# EAGLE design lyre_eye_stocks_40mm_breakout (EAGLE 9.6.2)
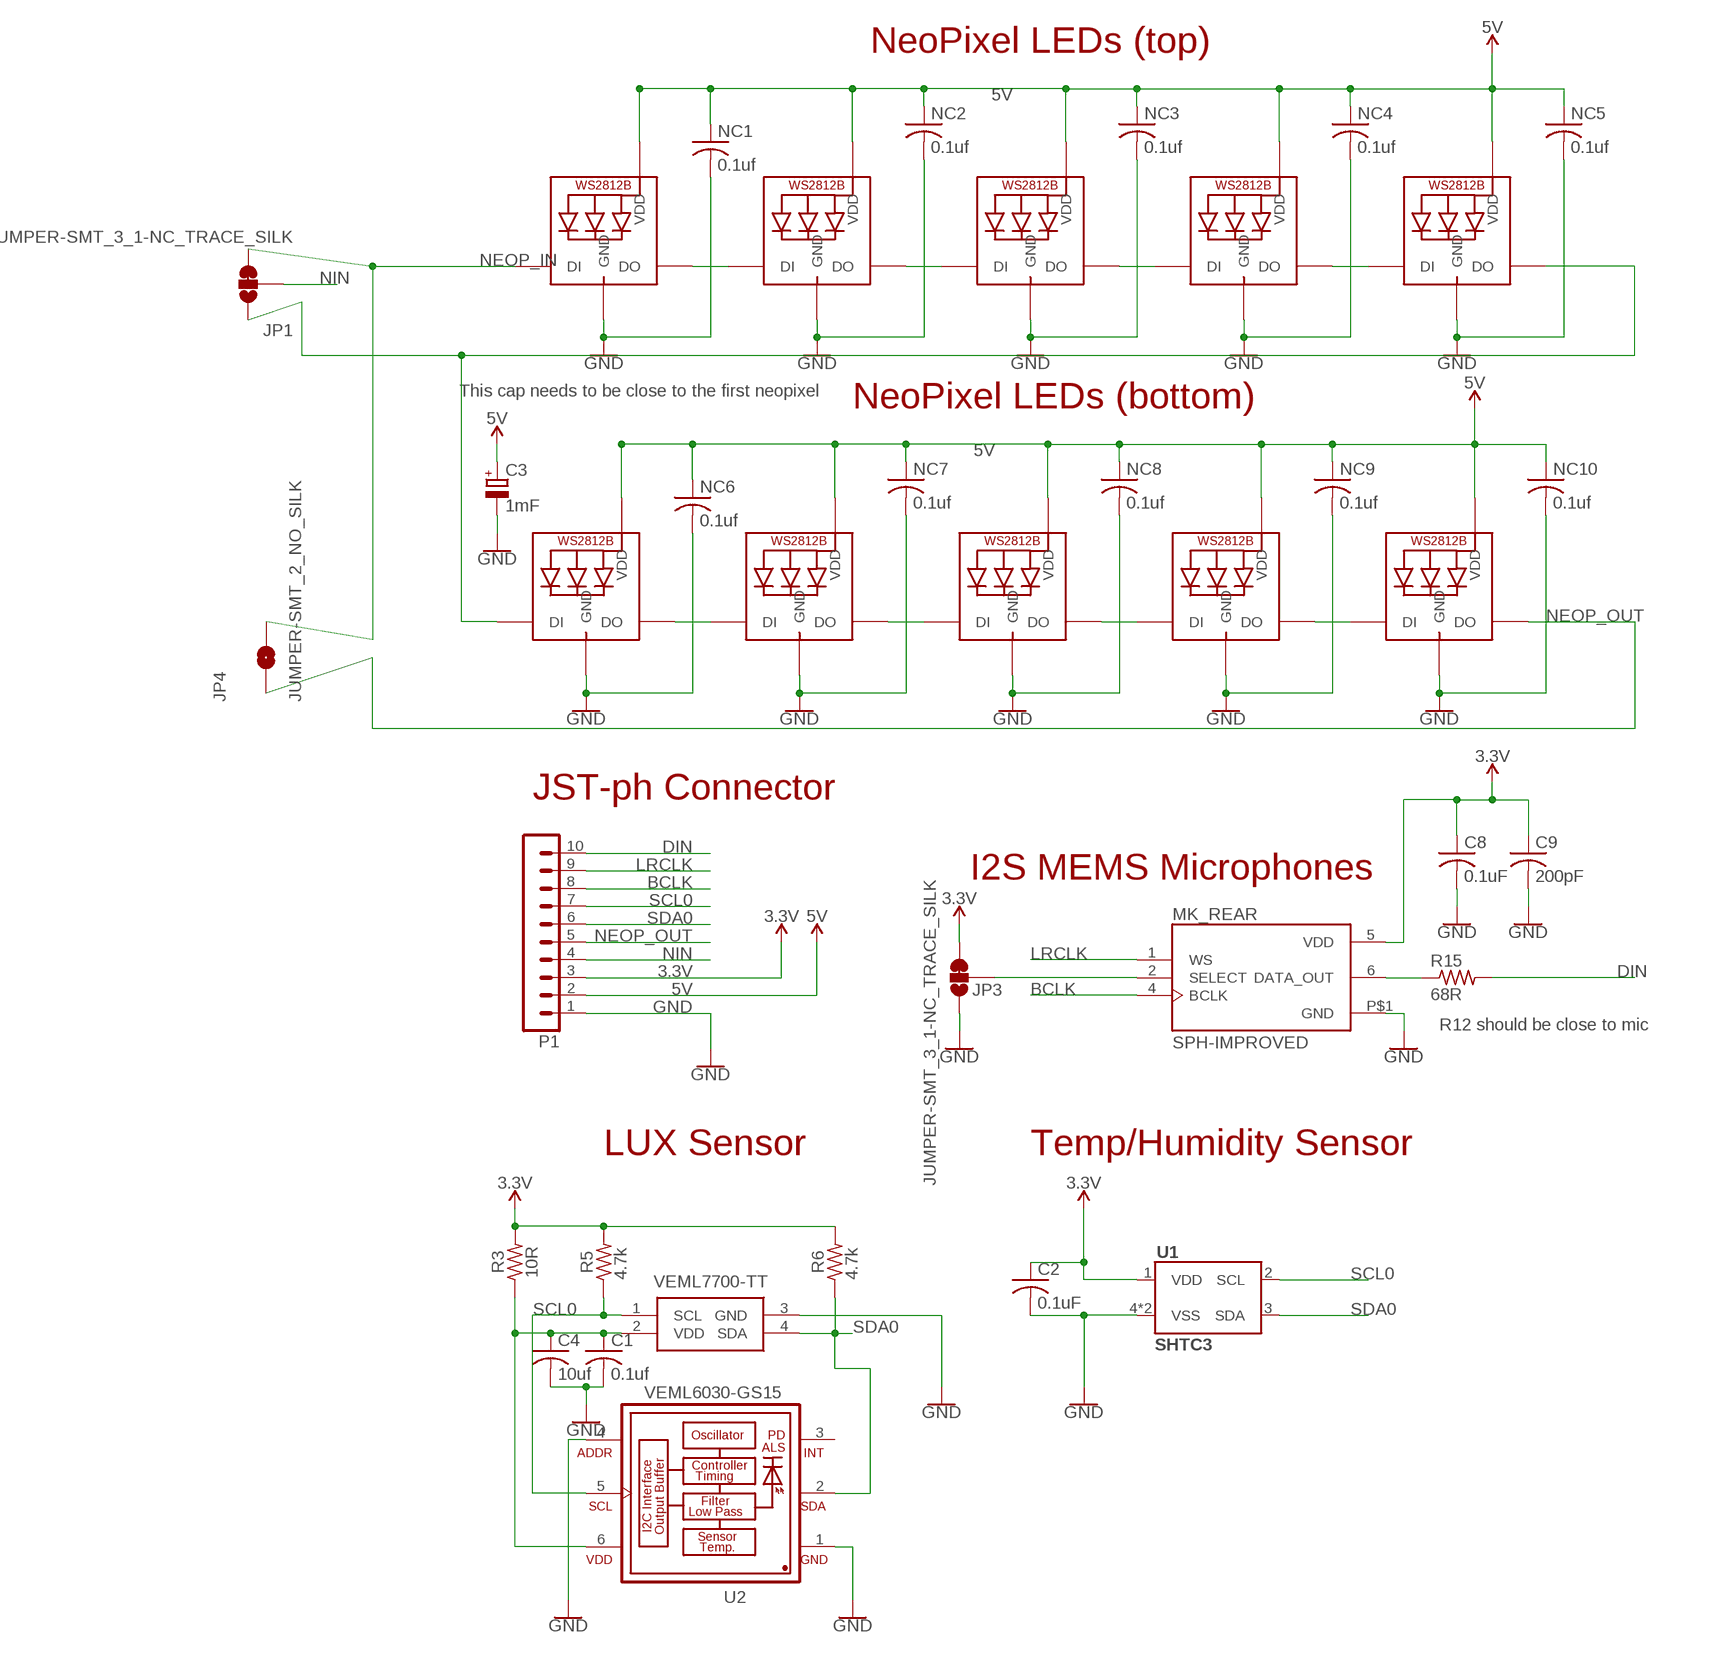
[diagram p0: schematic, sheet 1]

## Parts
C1  0.1uf  C-USC0805  [C0805]
C2  0.1uF  C-USC0805  [C0805]
C3  1mF  CPOL-EU153CLV-1012  [153CLV-1012]
C4  10uf  C-USC0805  [C0805]
C8  0.1uF  C-USC0805  [C0805]
C9  200pF  C-USC0805  [C0805]
JP1  JUMPER-SMT_3_1-NC_TRACE_SILK  [SMT-JUMPER_3_1-NC_TRACE_SILK]
JP3  JUMPER-SMT_3_1-NC_TRACE_SILK  [SMT-JUMPER_3_1-NC_TRACE_SILK]
JP4  JUMPER-SMT_2_NO_SILK  [SMT-JUMPER_2_NO_SILK]
MK_REAR  SPH-IMPROVED  [MIC_SPH0645LM4H-B_LARGER_RING]
NC1  0.1uf  C-USC0805  [C0805]
NC2  0.1uf  C-USC0805  [C0805]
NC3  0.1uf  C-USC0805  [C0805]
NC4  0.1uf  C-USC0805  [C0805]
NC5  0.1uf  C-USC0805  [C0805]
NC6  0.1uf  C-USC0805  [C0805]
NC7  0.1uf  C-USC0805  [C0805]
NC8  0.1uf  C-USC0805  [C0805]
NC9  0.1uf  C-USC0805  [C0805]
NC10  0.1uf  C-USC0805  [C0805]
NEO_01  WS2812  [WS2812B]
NEO_02  WS2812  [WS2812B]
NEO_03  WS2812  [WS2812B]
NEO_04  WS2812  [WS2812B]
NEO_05  WS2812  [WS2812B]
NEO_06  WS2812  [WS2812B]
NEO_07  WS2812  [WS2812B]
NEO_08  WS2812  [WS2812B]
NEO_09  WS2812  [WS2812B]
NEO_10  WS2812  [WS2812B]
P1  B10B-PH-K  [B10B-PH-K]
R3  10R  R-US_R0805  [R0805]
R5  4.7k  R-US_R0805  [R0805]
R6  4.7k  R-US_R0805  [R0805]
R15  68R  R-US_R0805  [R0805]
U1  SHTC3  [SHTC3]
U2  VEML6030-GS15  [VISHAY_VEML6030_2X2X0.87]
VEML_F  VEML7700-TT  [VEML7700]

## Nets
3.3V: C2.1 C8.1 C9.1 JP3.3 MK_REAR.5(VDD) P1.3 R3.2 R5.2 R6.2 U1.1(VDD)
5V: C3.+ NC1.1 NC2.1 NC3.1 NC4.1 NC5.1 NC6.1 NC7.1 NC8.1 NC9.1 NC10.1 NEO_01.1-VDD(VDD) NEO_02.1-VDD(VDD) NEO_03.1-VDD(VDD) NEO_04.1-VDD(VDD) NEO_05.1-VDD(VDD) NEO_06.1-VDD(VDD) NEO_07.1-VDD(VDD) NEO_08.1-VDD(VDD) NEO_09.1-VDD(VDD) NEO_10.1-VDD(VDD) P1.2
BCLK: MK_REAR.4(BCLK) P1.8
DIN: P1.10 R15.2
GND: C1.2 C2.2 C3.- C4.2 C8.2 C9.2 JP3.1 MK_REAR.P$1(GND) NC1.2 NC2.2 NC3.2 NC4.2 NC5.2 NC6.2 NC7.2 NC8.2 NC9.2 NC10.2 NEO_01.3-GND(GND) NEO_02.3-GND(GND) NEO_03.3-GND(GND) NEO_04.3-GND(GND) NEO_05.3-GND(GND) NEO_06.3-GND(GND) NEO_07.3-GND(GND) NEO_08.3-GND(GND) NEO_09.3-GND(GND) NEO_10.3-GND(GND) P1.1 U1.4(VSS) U1.5(VSS) U2.1(GND) U2.4(ADDR) VEML_F.3(GND)
LRCLK: MK_REAR.1(WS) P1.9
N$1: C1.1 C4.1 R3.1 U2.6(VDD) VEML_F.2(VDD)
N$2: JP1.1 NEO_05.2-DOUT(DO) NEO_06.4-DIN(DI)
N$4: NEO_02.2-DOUT(DO) NEO_03.4-DIN(DI)
N$5: NEO_09.2-DOUT(DO) NEO_10.4-DIN(DI)
N$6: JP3.2 MK_REAR.2(SELECT)
N$7: NEO_07.2-DOUT(DO) NEO_08.4-DIN(DI)
N$8: NEO_04.2-DOUT(DO) NEO_05.4-DIN(DI)
N$9: NEO_08.2-DOUT(DO) NEO_09.4-DIN(DI)
N$10: NEO_03.2-DOUT(DO) NEO_04.4-DIN(DI)
N$17: MK_REAR.6(DATA_OUT) R15.1
NEO_P1: NEO_01.2-DOUT(DO) NEO_02.4-DIN(DI)
NEO_P2: NEO_06.2-DOUT(DO) NEO_07.4-DIN(DI)
NEOP_IN: JP1.3 JP4.2 NEO_01.4-DIN(DI)
NEOP_OUT: JP4.1 NEO_10.2-DOUT(DO) P1.5
NIN: JP1.2 P1.4
SCL0: P1.7 R5.1 U1.2(SCL) U2.5(SCL) VEML_F.1(SCL)
SDA0: P1.6 R6.1 U1.3(SDA) U2.2(SDA) VEML_F.4(SDA)
Unconnected: U2.3(INT)

## Notes on the sheet
- NeoPixel LEDs (top)
- This cap needs to be close to the first neopixel
- NeoPixel LEDs (bottom)
- JST-ph Connector
- I2S MEMS Microphones
- R12 should be close to mic
- LUX Sensor | Temp/Humidity Sensor
- 10R | 4.7k | 4.7k

## Library data of the parts
C1 C2 C4 C8 C9 NC1-NC10 = rcl:C-US: CAPACITOR, American symbol; SPICEPREFIX: C
C3 = rcl:CPOL-EU: POLARIZED CAPACITOR, European symbol; SPICEPREFIX: C
JP1 JP3 = SparkFun-Jumpers:JUMPER-SMT_3_1-NC_TRACE: Normally closed trace jumper (1 of 2 connections) This jumper has a trace between two pads so it's normally closed (NC). The other connection is normally open (NO). Use a razor knife to open the connection. For best results follow the IPC guidelines for cutting traces: Cutout at least 0.063 mm (0.005 in). Remove all loose material to clean up the cut area. Seal the cut with an approved epoxy. Reapply solder to reclose the connection, or to close the NO connection.
JP4 = SparkFun-Jumpers:JUMPER-SMT_2_NO: Normally open jumper This jumper has two pads in close proximity to each other. Apply solder to close the connection. Round pads are easier to solder for beginners, but are a lot larger. SparkFun Product that uses the round pads: SparkFun EL Sequencer <https://www.sparkfun.com/products/12781>
MK_REAR = SPH0645LM4H-B:SPH-IMPROVED
NEO_01-NEO_09 NEO_10 = WS2812B:WS2812
P1 = con-jst-ph:B10B-PH-K: HEADER
R3 R5 R6 R15 = PulseOximeterECG_AU:R-US_: RESISTOR, American symbol; SPICEPREFIX: R
U1 = SHTC3:SHTC3
U2 = VEML6030-GS15:VEML6030-GS15: VEML6030 High Accuracy Ambient Light Sensor with I2C Interface: VEML6030 is a high accuracy ambient light digital 16-bit resolution sensor in a miniature transparent 2 mm x 2 mm package. It includes a high sensitive photodiode, a low noise amplifier, a 16-bit A/D converter and supports an easy to use I2C bus communication interface and additional interrupt feature. The ambient light result is as digital value available. Device Model created 15.06.2016 by Johannes Kolb - Vishay Semiconductor GmbH; AVAILABILITY: Unavailable; DESCRIPTION: Optical Sensor Ambient 550nm I²C 6-SMD, No Lead; MF: Vishay Semiconductor; MP: VEML6030-GS15; PACKAGE: SMD-6 Vishay; PRICE: None
VEML_F = VEML7700-TT:VEML7700-TT: 16Bit Ambient Light Sensor I2C 6.8x2.3mm Source: Datasheet <https://www.arrow.com/en/products/veml7700-tt/vishay>; DESCRIPTION: 16Bit Ambient Light Sensor I2C 6.8x2.3mm; HEIGHT: mm; MANUFACTURER_NAME: Vishay; MANUFACTURER_PART_NUMBER: VEML7700-TT; MOUSER_PART_NUMBER: 78-VEML7700-TT; MOUSER_PRICE-STOCK: https://www.mouser.com/Search/Refine.aspx?Keyword=78-VEML7700-TT; RS_PART_NUMBER: 1226791P; RS_PRICE-STOCK: http://uk.rs-online.com/web/p/products/1226791P

## Net classes
0 default: width 0.203 mm, drill 0.254 mm, clearance 0.203 mm

## Board
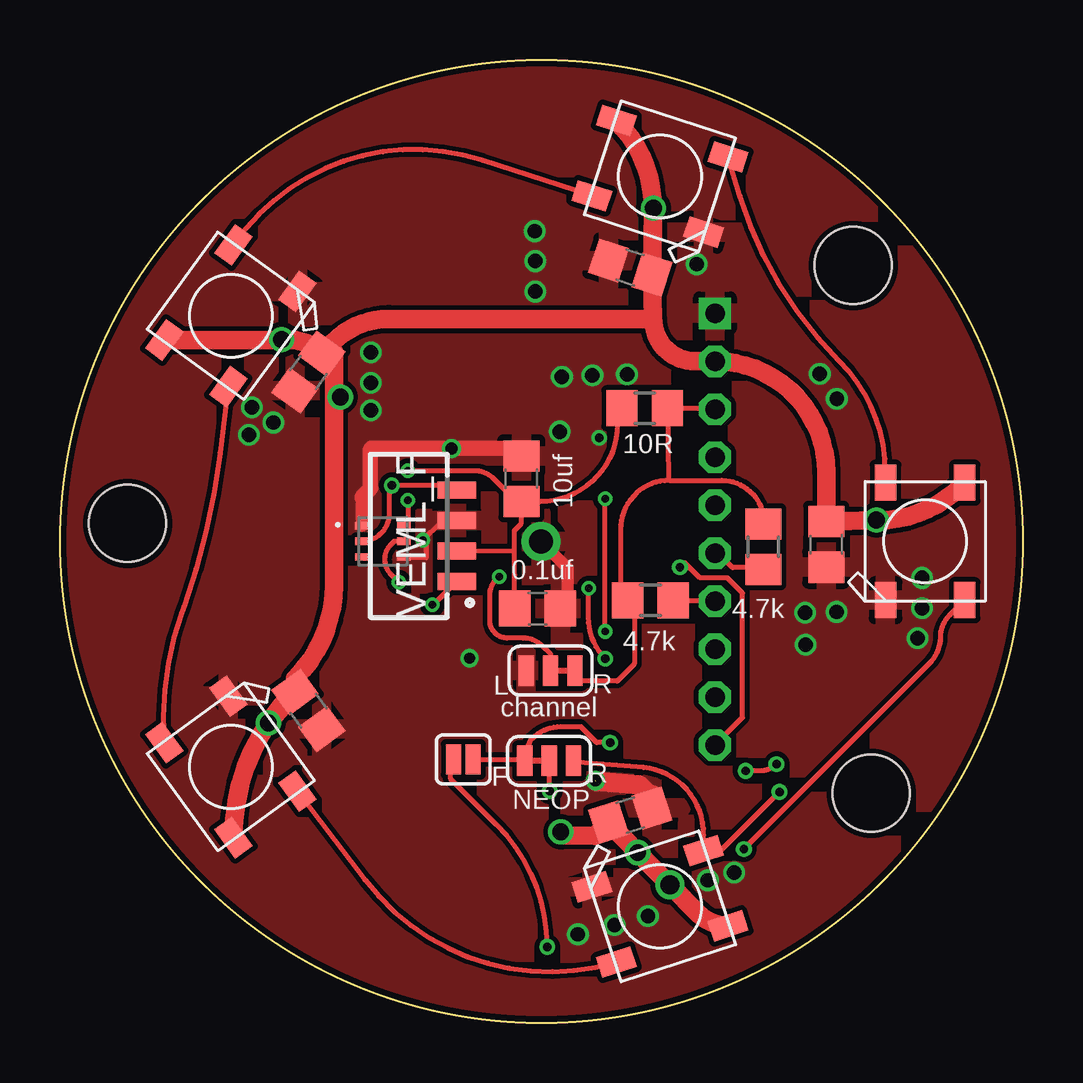
[diagram p1: board, top side]
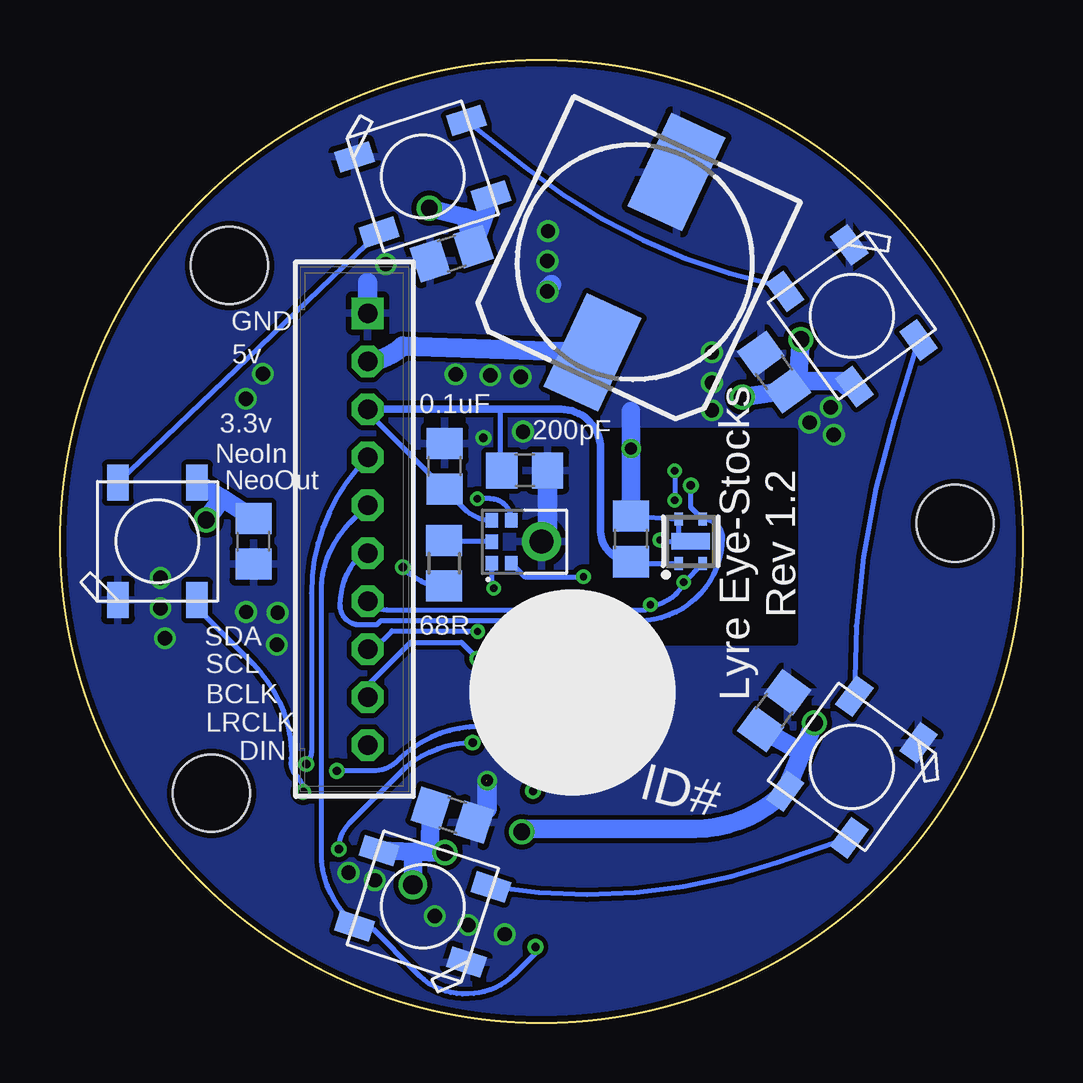
[diagram p2: board, bottom side, seen from below]

Size 40.13 x 40.13 mm. Coordinates in mm from the lower left corner, seen from the top.
Outline: circle at 20.07,20.07 radius 20.07
Copper layers (1*16): Top 0.035mm / dielectric 1.5mm / Bottom 0.035mm
Design rules "SeeedStudio_2layer_DRU_no_angle_20140221": minimum track width 6mil, minimum drill 12mil, track to track 6mil, track to pad 6mil, pad to pad 6mil, via to via 6mil, smd to smd 0mil, copper to edge 10mil, drill to drill 10mil, minimum pad ring 10mil, minimum via ring 6mil, stop-mask expansion 2mil, vias tented up to drill 100mil, thermal gap 10mil
Holes 3.2 mm at 33.82,9.57 2.82,20.82 33.07,31.57

### Footprints (pad centres in the part's own frame; a part is rotated, then mirrored left to right if it is on the bottom)
C0805 = smd 1.3 x 1.5: 1 -0.95,0; 2 0.95,0
153CLV-1012 = smd 4.3 x 2.5: + 4.15,0; - -4.15,0
SMT-JUMPER_3_1-NC_TRACE_SILK = smd 0.635 x 1.27: 1 -1.016,0; 2 0,0; 3 1.016,0
SMT-JUMPER_2_NO_SILK = smd 0.635 x 1.27: 1 -0.406,0; 2 0.406,0
MIC_SPH0645LM4H-B_LARGER_RING = smd 0.6 x 0.522: 1 -0.9,2.074; 2 -0.9,1.252; 4 0.9,1.252; 5 0.9,2.074; 6 0,2.074 | drill 1 pad 1.626: P$1 0,0
WS2812B = smd 1.5 x 0.9: 1-VDD 2.45,-1.65; 2-DOUT 2.45,1.65; 3-GND -2.45,1.65; 4-DIN -2.45,-1.65
B10B-PH-K = drill 0.813 square: 1 -9,0 | drill 0.813 octagon: 2 -7,0; 3 -5,0; 4 -3,0; 5 -1,0; 6 1,0; 7 3,0; 8 5,0; 9 7,0; 10 9,0
R0805 = smd 1.3 x 1.5: 1 -0.95,0; 2 0.95,0
SHTC3 = smd 0.55 x 0.35: 1 -0.925,0.5; 2 -0.925,-0.5; 3 0.925,-0.5; 4 0.925,0.5 | smd 0.7 x 1.6: 5 0,0
VISHAY_VEML6030_2X2X0.87 = smd 0.55 x 0.3: 1 -0.875,0.65; 2 -0.875,0; 3 -0.875,-0.65; 4 0.875,-0.65; 5 0.875,0; 6 0.875,0.65
VEML7700 = smd 0.7 x 1.6: 1 1.495,-0.4; 2 2.765,-0.4; 3 4.035,-0.4; 4 5.305,-0.4

### Placement (x,y rotation side)
C1  19.91,17.26 0 top
C2  16.33,20.17 90 bottom
C3  16.18,31.7 245 bottom
C4  19.23,22.67 90 top
C8  24.1,23.2 90 bottom
C9  20.76,23.03 0 bottom
JP1  20.39,10.91 180 top
JP3  20.45,14.68 0 top
JP4  16.81,10.98 0 top
MK_REAR  20.06,20.05 90 bottom
NC1  31.94,19.94 270 top
NC2  23.77,31.48 162 top
NC3  10.36,27.12 234 top
NC4  10.36,13.01 306 top
NC5  23.77,8.65 18 top
NC6  32.07,20.07 270 bottom
NC7  23.8,32.06 198 bottom
NC8  10.36,27.12 126 bottom
NC9  10.36,13.01 54 bottom
NC10  23.77,8.65 342 bottom
NEO_01  36.07,20.07 90 top
NEO_02  25.01,35.28 162 top
NEO_03  7.12,29.47 234 top
NEO_04  7.12,10.66 306 top
NEO_05  25.01,4.85 18 top
NEO_06  36.07,20.07 90 bottom
NEO_07  25.01,35.28 18 bottom
NEO_08  7.12,29.47 306 bottom
NEO_09  7.12,10.66 234 bottom
NEO_10  25.01,4.85 162 bottom
P1  27.3,20.57 270 bottom
R3  24.37,25.61 0 top
R5  24.61,17.6 180 top
R6  29.32,19.84 90 top
R15  24.11,19.15 270 bottom
U1  13.84,20.07 90 bottom
U2  13.46,20.07 0 top
VEML_F  16.14,16.9 90 top

### Tracks (layer width: path | path; a pad name or v marks a point on that pad's centre or on a via)
3.3V
  Top 0.203: P1.3 27.27,25.61 R3.2 25.37,22.63 25.4,22.61 | 23.39,17.38 23.37,17.36 23.37,20.57 arc-90 25.4,22.61 | 23.39,17.38 23.95,17.93 23.95,14.95 23.24,14.24 21.7,14.24 JP3.3 | 23.39,17.38 R5.2 | 25.4,22.61 27.59,22.61 arc-90 29.34,20.86 R6.2
  Bottom 0.203: MK_REAR.5 arc45 23.28,21.43 C8.1 27.3,25.45 P1.3 | C9.1 21.78,23.09 21.78,25.57 | C2.1 16.1,19.14 U1.1
  Bottom 0.305: C2.1 arc90 17.6,20.6 17.6,23.93 arc-90 19.25,25.57 21.78,25.57 P1.3
5V  (via drill 0.7, 0.8)
  Top 0.762: 24.72,29.34 arc90 26.49,27.57 P1.2 arc-90 31.94,22.94 NC1.1 | 24.72,29.34 NC2.1 | NEO_02.1-VDD arc-45 24.72,33.9 NC2.1 | NC3.1 11.39,28.38 arc-45 13.71,29.34 24.72,29.34 | NEO_03.1-VDD 9.22,28.46 | 9.22,28.46 9.67,28.46 arc-45 NC3.1 | NEO_04.1-VDD arc-45 9.75,13.8 NC4.1 | NC4.1 9.8,14.35 arc45 11.42,18.25 11.42,27.96 NC3.1 | NEO_05.1-VDD arc-45 26.62,4.55 v25.42,5.75 24.07,7.1 | 24.07,7.1 NC5.1 | NC1.1 34.06,20.94 arc45 37.61,22.4 NEO_01.1-VDD | v9.25,28.47 9.22,28.46 | v24.08,7.09 24.07,7.1 | NC1.1 v34.04,20.95 | v8.69,12.5 NC4.1 | v24.74,33.96 NC2.1 | NC5.1 22.48,7.96 | v20.88,7.95 21.02,7.81 22.31,7.8 NC5.1
  Bottom 0.762: v8.69,12.5 9.21,11.27 | 9.21,11.27 NEO_09.1-VDD arc45 13.66,8.09 20.74,8.09 v20.88,7.95 | NC9.1 9.21,11.27 | NEO_10.1-VDD 25.36,7.13 | 25.36,7.13 24.71,7.11 | 24.71,7.11 v24.08,7.09 | NC10.1 24.71,7.11 | NEO_06.1-VDD 33.38,21.88 | 33.38,21.88 NC6.1 | v34.04,20.95 33.38,21.88 | NEO_07.1-VDD 22.52,33.39 | 22.52,33.39 NC7.1 23.25,33.58 | v24.74,33.96 23.25,33.58 | 23.25,33.58 22.52,33.39 | NEO_08.1-VDD 7.32,26.52 7.55,26.74 9.37,26.74 | 9.37,26.74 9.37,26.75 NC8.1 v11.68,26.09 | v9.25,28.47 9.37,26.74 | v25.42,5.75 25.42,7.07 25.36,7.13
  Bottom 0.813: P1.2 arc-39 25.85,28.2 C3.+
BCLK  (via drill 0.3)
  Top 0.203: v22.73,21.84 22.7,21.81 22.7,16.28 v22.72,16.3 v22.72,16.31
  Bottom 0.203: MK_REAR.4 arc-90 22.2,21.84 v22.73,21.84 | P1.8 27.05,15.57 26.29,16.34 22.75,16.34 v22.72,16.31
DIN  (via drill 0.35)
  Top 0.203: P1.10 28.45,12.72 28.45,17.91 27.81,18.54 26.68,18.54 26.04,19.18 v25.84,18.99
  Bottom 0.203: v25.84,18.99 25.73,18.87 arc-45 R15.2
GND  (via drill 0.3, 0.35, 0.45, 0.5, 0.6)  (1 unrouted)
  Top 0.203: U2.4 15.25,19.42 15.28,19.39 15.28,19.97 v15.12,20.12 15.88,20.88 16.48,20.88 VEML_F.3
  Top 0.508: C1.2 21.14,17.26 21.15,17.29 21.16,18.95 MK_REAR.P$1 | U2.1 12.59,21.9
  Top 0.635: C4.2 18.9,23.95 12.95,23.95 12.95,22.27 12.59,21.9
  Top 0.813: 24.68,9.38 24.14,9.92 22.35,10.06
  Top 1.016: NC5.2 24.68,9.38
  Bottom 0.203: C2.2 U1.4 14.34,20.2 14.48,20.07 | 14.48,20.07 U1.5 | v15.12,20.12 15.06,20.07 14.48,20.07
  Bottom 0.762: C2.2 16.33,25.5
  Bottom 0.813: 19.81,30.61 19.64,30.77 | P1.1 27.3,30.86 | C9.2 19.81,20.62 MK_REAR.P$1 | NC10.2 22.32,8.91 v22.32,10.09
  other vias: 21.59,3.68 23.11,4.06 24.51,4.44 8,25.65 8.89,25.02 7.87,24.51 26.54,31.62 31.67,27.05 32.38,26.01 35.94,18.54 35.94,17.27 35.76,16.03 20.92,26.92 23.64,27.03 22.19,26.98 12.95,25.53 12.95,26.67 12.95,27.94 22.48,24.38 20.83,24.64 17.08,15.2 19.81,30.48 19.81,31.75 19.79,32.99 27.01,5.93 28.1,6.26 31.09,15.76 31.06,17.09 32.37,17.12 16.32,23.93
  pour Top: 0.19,19.37 0.19,20.57 arc-90 19.71,40.09 20.72,40.09 arc-90 40,20.81 40,19.63 arc-90 20.59,0.21 19.35,0.21 arc-90
  pour Bottom: 20.58,39.88 19.16,39.88 arc90 0.18,20.9 0.18,19.4 arc90 19.55,0.03 20.03,0.03 arc90 40.09,20.09 40.09,20.37 arc90
  cutout Bottom: 9.52,24.64 9.52,15.88 17.91,15.88 17.91,24.64
LRCLK  (via drill 0.3, 0.35)  (1 unrouted)
  Top 0.203: v22.04,18.11 22.02,18.09 22.02,16.89 arc45 v22.73,15.18
  Bottom 0.203: MK_REAR.1 22.13,18.2 v22.04,18.11 | P1.9 27.3,14.06 25.52,15.85 23.4,15.85 v22.73,15.18
N$1  (via drill 0.3)
  Top 0.203: R3.1 23.24,25.48 23.24,24.96 arc-90 20,21.72 C4.1 | 18.94,19.69 18.94,19.59 18.96,18.67 C1.1 | 18.94,19.69 18.94,20.51 19.23,20.81 C4.1 | VEML_F.2 18.94,19.69 | C4.1 19.04,21.72 18.1,22.66 arc45 17.27,23.01 v14.5,23.01 | v14.5,21.77 14.5,20.88 U2.6
  Bottom 0.203: v14.5,23.01 v14.5,21.77
N$2  (via drill 0.35)
  Top 0.203: v29.99,9.62 27.55,7.17 NEO_05.2-DOUT 26.83,7.83 arc85 24.32,10.64 21.6,10.86 21.55,10.91 JP1.1
  Bottom 0.203: NEO_06.4-DIN 34.42,17.29 32.11,14.98 arc45 30.48,11.05 30.5,11.04 30.5,10.84 arc-45 30.27,10.28 arc45 v29.99,9.62
N$4
  Top 0.203: NEO_02.2-DOUT 17.6,35.95 arc73 NEO_03.4-DIN
N$5
  Bottom 0.203: NEO_09.2-DOUT 10.24,6.67 arc29 NEO_10.4-DIN
N$6  (via drill 0.3)
  Top 0.203: v18.31,18.59 18.22,18.49 18.22,18.53 arc45 17.92,17.81 17.92,16.75 arc90 18.63,16.04 19.32,16.04 arc-45 20.1,15.71 20.45,15.36 JP3.2
  Bottom 0.203: MK_REAR.2 20.75,18.59 v18.31,18.59
N$7
  Bottom 0.203: NEO_07.2-DOUT 20.71,35.65 arc-26 10.36,30.76 NEO_08.4-DIN
N$8
  Top 0.203: NEO_04.2-DOUT 12.72,5.95 arc69 NEO_05.4-DIN
N$9
  Bottom 0.203: NEO_08.2-DOUT 5.37,25.09 arc-18 NEO_09.4-DIN
N$10
  Top 0.203: NEO_03.2-DOUT 6.68,23.75 arc-13 5.17,17.36 5.07,17.08 arc24 NEO_04.4-DIN
N$17
  Bottom 0.203: MK_REAR.6 24.06,20.05 R15.1
NEO_P1
  Top 0.203: NEO_01.2-DOUT 34.42,22.93 arc45 32.49,27.58 arc-28 28.35,34.46 NEO_02.4-DIN
NEO_P2
  Bottom 0.203: NEO_06.2-DOUT NEO_07.4-DIN
NEOP_IN  (via drill 0.35)
  Top 0.203: JP4.2 19.54,10.97 19.54,10.96 JP1.3 19.54,11.59 arc-31 19.69,11.86 arc-45 20.87,12.34 21.7,12.34 22.37,11.68 v22.93,11.68 | NEO_01.4-DIN 37.06,16.96 arc45 36.7,16.09 arc-45 36.23,14.97 v28.51,7.24
  Bottom 0.203: v28.51,7.24 arc45 28.06,8.32 25.96,10.42 arc45 v22.93,11.68
NEOP_OUT  (via drill 0.35)
  Top 0.203: JP4.1 16.41,11 16.35,11.11 16.27,11.2 16.27,10.19 18.18,8.28 arc-45 20.29,3.18 v20.31,3.16
  Bottom 0.203: NEO_10.2-DOUT 27.88,4.08 | 27.88,4.08 27.72,3.89 27.07,3.89 25.29,2.11 arc-53 23.11,1.21 arc-45 21.2,2 20.31,2.89 v20.31,3.16 | 27.88,4.08 28.29,4.54 arc41 29.23,7.09 29.23,17.97 arc45 28.05,20.83 P1.5
NIN  (via drill 0.35)
  Top 0.203: v29.87,10.77 arc-45 29.2,10.5 v28.59,10.5 | JP1.2 20.39,9.68 v20.41,9.66
  Bottom 0.203: P1.4 arc-45 29.65,17.91 29.65,11.3 arc45 v29.87,10.77 | v28.59,10.5 27.09,10.5 arc-45 26.04,10.93 arc45 22.64,12.34 22.29,12.34 arc45 21.06,11.83 arc45 20.41,10.27 v20.41,9.66
SCL0  (via drill 0.3)
  Top 0.203: P1.7 25.64,17.57 R5.1 | VEML_F.1 15.57,17.42 v15.52,17.42 | U2.5 13.92,20.07 13.79,19.94 arc90 13.79,18.69 v14.13,18.36
  Bottom 0.203: U1.2 v14.13,18.36 arc45 14.94,17.55 15.42,17.35 15.5,17.42 v15.52,17.42 15.74,17.2 26.4,17.2 arc45 P1.7
SDA0  (via drill 0.35)
  Top 0.203: P1.6 27.43,19.57 28.04,18.97 29.19,18.97 R6.1 | VEML_F.4 16.36,22.38 13.84,22.38 v13.83,22.39 13.72,22.28 13.72,21.2 arc-90 U2.2
  Bottom 0.203: v13.83,22.39 13.83,21.48 U1.3 13.28,20.99 arc90 12.52,20.23 arc90 16,16.75 26.76,16.75 26.93,16.59 27.65,16.59 arc90 28.45,17.39 28.45,17.39 arc45 27.54,19.57 P1.6

### Text on the board
bPlace: ID#
tNames: /Users/nathan/Desktop/moth_01.bmp | L | R | channel | F | R | NEOP
bNames: GND | 5v | 3.3v | NeoIn | NeoOut | Lyre Eye-Stocks / Rev 1.2 | SDA | SCL | BCLK | LRCLK | DIN
bValues: 0.1uF